# EAGLE design Board (EAGLE 9.0.1)
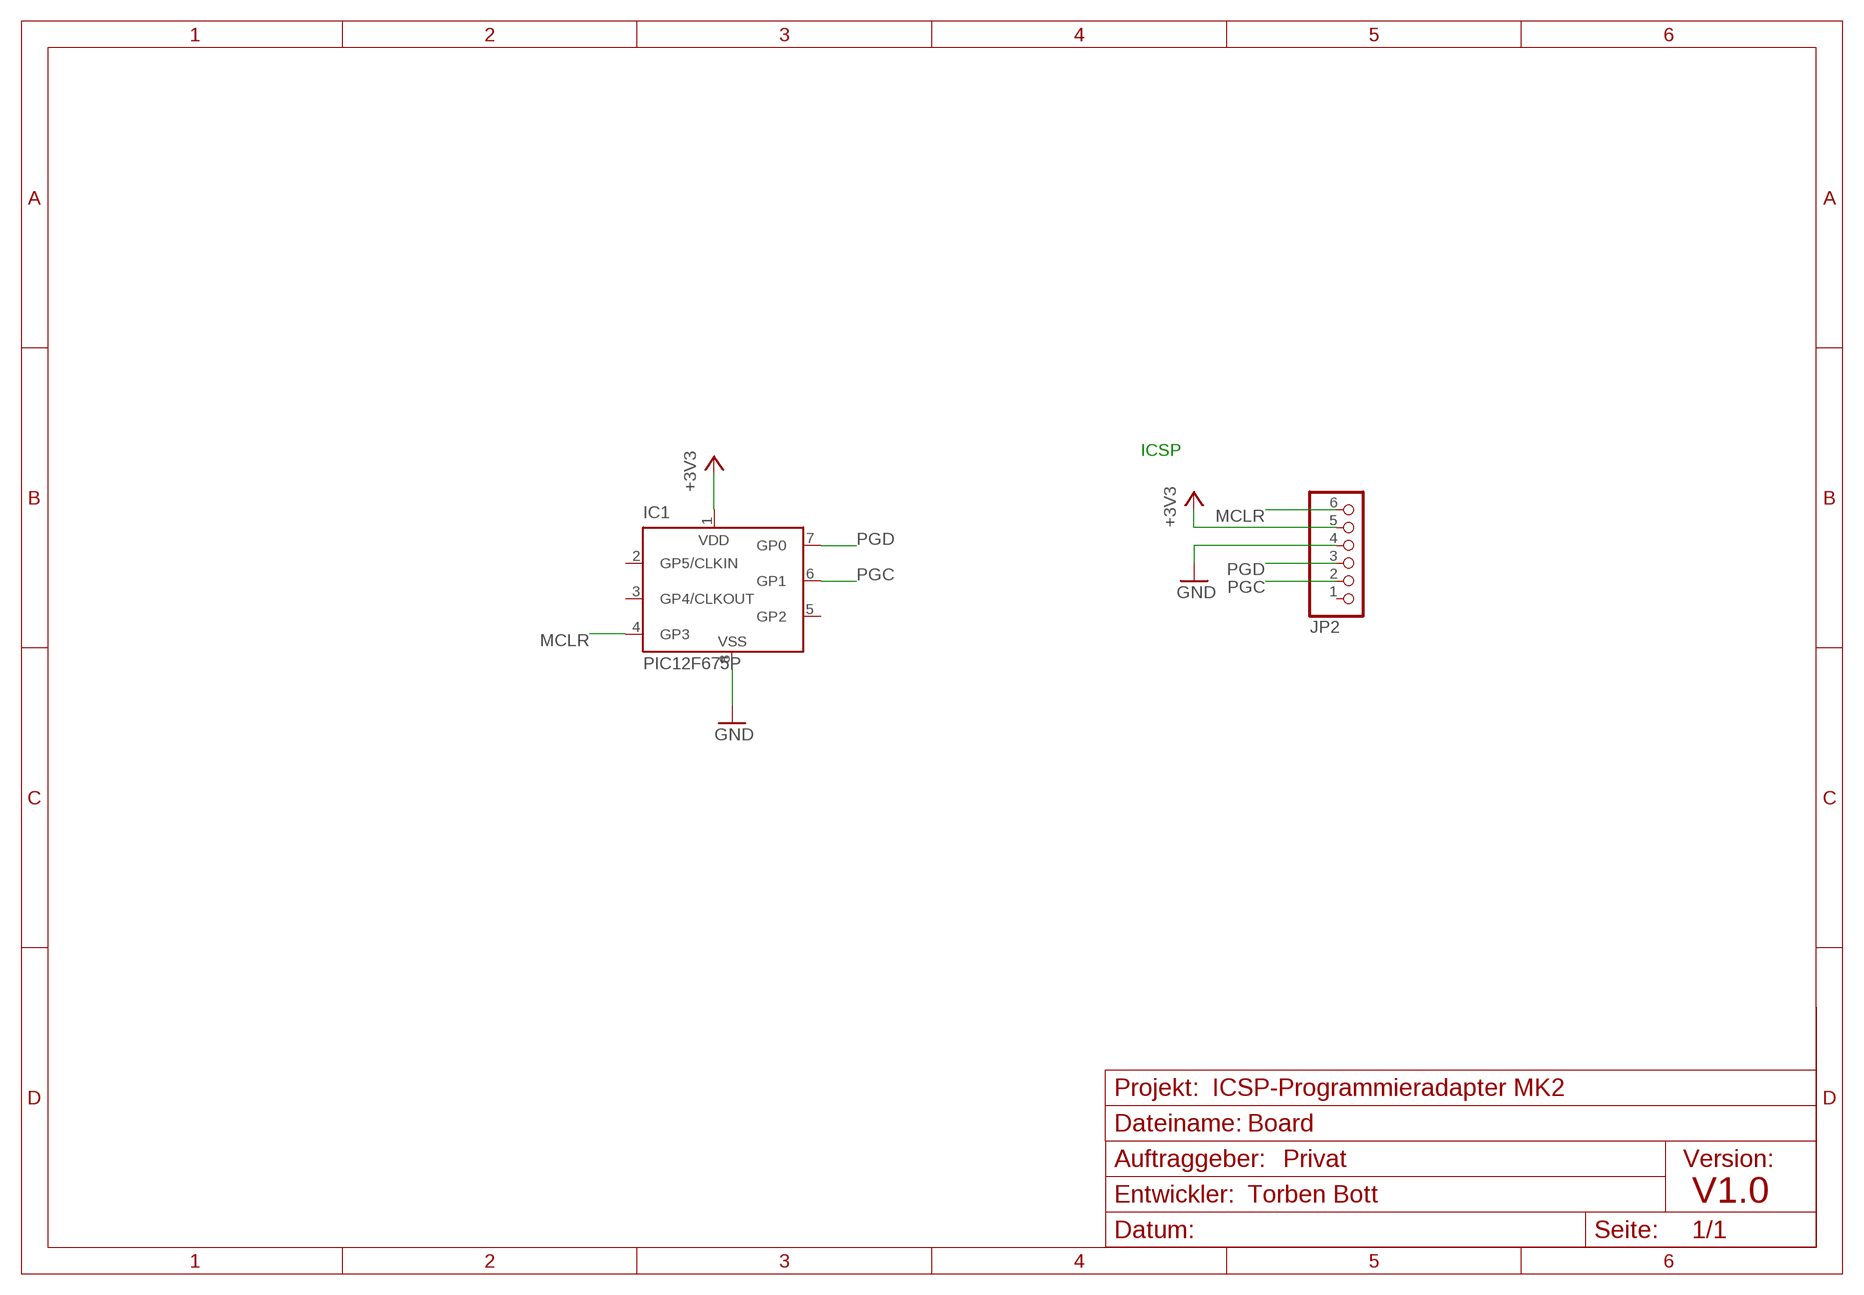
[diagram p0: schematic, sheet 1]

## Parts
IC1  PIC12F675P  [DIL8]
JP2  PINHD-1X6/90  [1X06/90]

## Nets
+3V3: IC1.1(VDD) JP2.5
GND: IC1.8(VSS) JP2.4
MCLR: IC1.4(GP3) JP2.6
PGC: IC1.6(GP1) JP2.2
PGD: IC1.7(GP0) JP2.3
Unconnected: IC1.2(GP5/CLKIN) IC1.3(GP4/CLKOUT) IC1.5(GP2) JP2.1

## Notes on the sheet
- ICSP
- ICSP-Programmieradapter MK2
- Privat
- Torben Bott | V1.0

## Library data of the parts
IC1 = microchip:PIC12F6*: Data Sheet 8-Pin FLASH-Based 8-Bit CMOS Microcontrollers Source: http://www.microchip.com .. 41190c.pdf; MF: MICROCHIP; MPN: PIC12F675-E/P; OC_FARNELL: 9759018; OC_NEWARK: 92C4340
JP2 = pinhead:PINHD-1X6: PIN HEADER

## Board
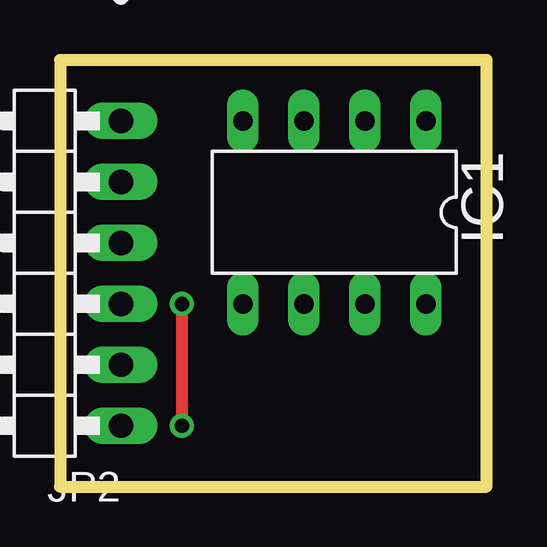
[diagram p1: board, top side]
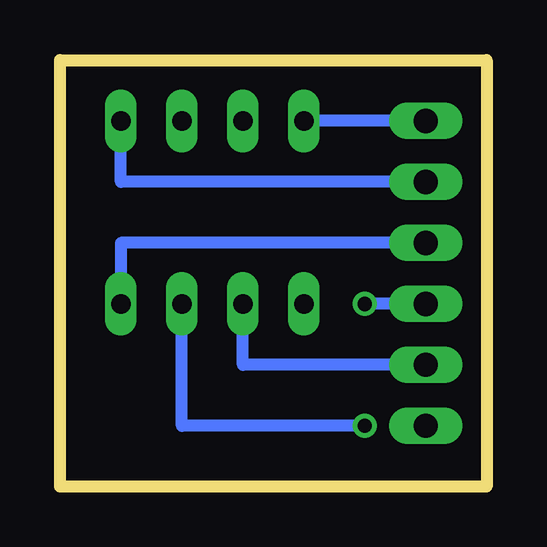
[diagram p2: board, bottom side, seen from below]

Size 17.78 x 17.78 mm. Coordinates in mm from the lower left corner, seen from the top.
Outline: 0,17.78 0,0 17.78,0 17.78,17.78 0,17.78
Copper layers (1*16): Top 0.035mm / dielectric 1.5mm / Bottom 0.035mm
Design rules "default": minimum track width 6mil, minimum drill 0.35mm, track to track 6mil, track to pad 6mil, pad to pad 6mil, via to via 6mil, smd to smd 6mil, copper to edge 40mil, drill to drill 6mil, minimum pad ring 10mil, minimum via ring 8mil, stop-mask expansion 4mil, vias tented up to drill 0mil, thermal gap 10mil

### Footprints (pad centres in the part's own frame; a part is rotated, then mirrored left to right if it is on the bottom)
DIL8 = drill 0.813 long: 1 -3.81,-3.81; 2 -1.27,-3.81; 3 1.27,-3.81; 4 3.81,-3.81; 5 3.81,3.81; 6 1.27,3.81; 7 -1.27,3.81; 8 -3.81,3.81
1X06/90 = drill 1.016 long: 1 -6.35,-3.81; 2 -3.81,-3.81; 3 -1.27,-3.81; 4 1.27,-3.81; 5 3.81,-3.81; 6 6.35,-3.81

### Placement (x,y rotation side)
IC1  11.43,11.43 180 top
JP2  -1.27,8.89 90 top

### Tracks (layer width: path | path; a pad name or v marks a point on that pad's centre or on a via)
+3V3
  Bottom 0.508: JP2.5 15.24,12.7 IC1.1
GND
  Bottom 0.508: JP2.4 15.24,10.16 IC1.8
MCLR
  Bottom 0.508: JP2.6 IC1.4
PGC
  Bottom 0.508: JP2.2 10.16,5.08 IC1.6
PGD  (via drill 0.6)
  Top 0.508: v5.08,7.62 v5.08,2.54
  Bottom 0.508: JP2.3 v5.08,7.62 | v5.08,2.54 12.7,2.54 IC1.7